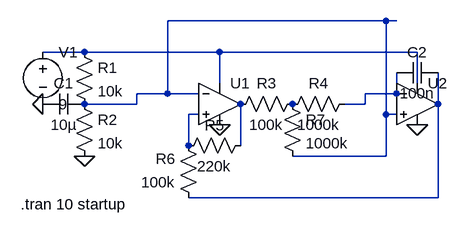
[diagram p0: schematic triangle wave oscillator.asc]
triangle wave oscillator.asc, the LTspice schematic file:
Version 4
SHEET 1 880 680
WIRE 304 -16 -32 -16
WIRE 320 -16 304 -16
WIRE -160 32 -224 32
WIRE 48 32 -160 32
WIRE 352 32 48 32
WIRE 48 80 48 32
WIRE 352 80 352 32
WIRE -32 96 -32 -16
WIRE -32 96 -80 96
WIRE 16 96 -32 96
WIRE 320 96 320 64
WIRE 320 96 272 96
WIRE -80 112 -80 96
WIRE -80 112 -160 112
WIRE 272 112 272 96
WIRE 272 112 240 112
WIRE 384 112 384 64
WIRE 16 128 0 128
WIRE 304 128 304 -16
WIRE 320 128 304 128
WIRE 0 176 0 128
WIRE 80 176 80 112
WIRE 304 192 304 128
WIRE 304 192 160 192
WIRE 384 256 384 112
WIRE 384 256 0 256
FLAG -224 112 0
FLAG -160 192 0
FLAG 352 144 0
FLAG 48 144 0
SYMBOL voltage -224 16 R0
WINDOW 123 0 0 Left 0
WINDOW 39 0 0 Left 0
SYMATTR InstName V1
SYMATTR Value 9
SYMBOL res -176 16 R0
SYMATTR InstName R1
SYMATTR Value 10k
SYMBOL res -176 96 R0
SYMATTR InstName R2
SYMATTR Value 10k
SYMBOL cap -160 96 R90
WINDOW 0 0 32 VBottom 2
WINDOW 3 32 32 VTop 2
SYMATTR InstName C1
SYMATTR Value 10µ
SYMBOL Opamps\\UniversalOpamp2 48 112 R0
SYMATTR InstName U1
SYMBOL Opamps\\UniversalOpamp2 352 112 R0
SYMATTR InstName U2
SYMBOL res 176 96 R90
WINDOW 0 0 56 VBottom 2
WINDOW 3 32 56 VTop 2
SYMATTR InstName R3
SYMATTR Value 100k
SYMBOL res 256 96 R90
WINDOW 0 0 56 VBottom 2
WINDOW 3 32 56 VTop 2
SYMATTR InstName R4
SYMATTR Value 1000k
SYMBOL res 96 160 R90
WINDOW 0 0 56 VBottom 2
WINDOW 3 32 56 VTop 2
SYMATTR InstName R5
SYMATTR Value 220k
SYMBOL res 16 272 R180
WINDOW 0 36 76 Left 2
WINDOW 3 36 40 Left 2
SYMATTR InstName R6
SYMATTR Value 100k
SYMBOL cap 384 48 R90
WINDOW 0 0 32 VBottom 2
WINDOW 3 32 32 VTop 2
SYMATTR InstName C2
SYMATTR Value 100n
SYMBOL res 144 96 R0
SYMATTR InstName R7
SYMATTR Value 1000k
TEXT -258 266 Left 2 !.tran 10 startup

The netlist it stands for:
* triangle wave oscillator.asc
V1 N002 0 9
R1 N002 N001 10k
R2 N001 0 10k
C1 N001 0 10µ
XU1 N005 N001 N002 0 N006 level.2 Avol=1Meg GBW=10Meg Slew=10Meg ilimit=25m rail=0 Vos=0 phimargin=45 en=0 enk=0 in=0 ink=0 Rin=500Meg  ; pins IN+ IN- V+ V- OUT
XU2 N001 N003 N002 0 N004 level.2 Avol=1Meg GBW=10Meg Slew=10Meg ilimit=25m rail=0 Vos=0 phimargin=45 en=0 enk=0 in=0 ink=0 Rin=500Meg  ; pins IN+ IN- V+ V- OUT
R3 P001 N006 100k
R4 N003 P001 1000k
R5 N006 N005 220k
R6 N004 N005 100k
C2 N004 N003 100n
R7 P001 N001 1000k
.tran 10 startup
.lib UniversalOpamps2.sub
.backanno
.end